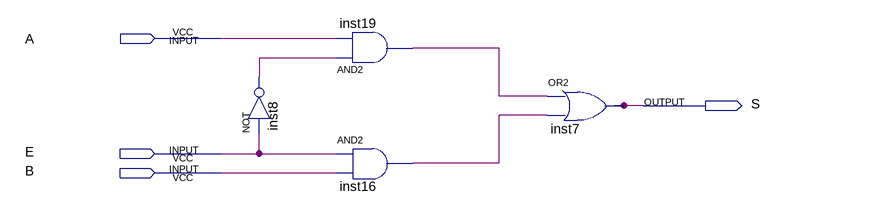
[diagram p0: schematic sheet]
// Quartus schematic Multi_2_1.bdf as structural Verilog: 4 symbols, 4 pins
module Multi_2_1 (
  input  A,
  input  E,
  input  B,
  output S
);

  wire inst8_out, inst16_out, inst19_out;

  not inst8 (inst8_out, E);
  and inst19 (inst19_out, inst8_out, A);
  and inst16 (inst16_out, E, B);
  or inst7 (S, inst19_out, inst16_out);
endmodule
